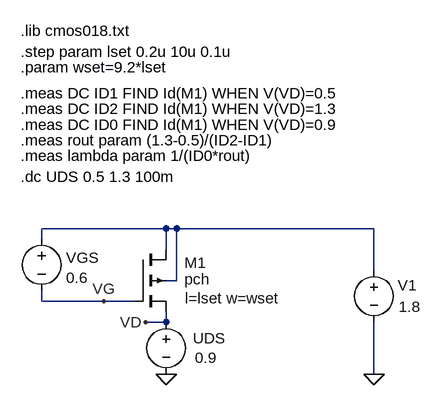
[diagram p0: schematic Draft4P.asc]
Draft4P.asc, the LTspice schematic file:
Version 4
SHEET 1 928 680
WIRE 256 64 64 64
WIRE 272 64 256 64
WIRE 576 64 272 64
WIRE 64 80 64 64
WIRE 256 96 256 64
WIRE 576 128 576 64
WIRE 272 144 272 64
WIRE 272 144 256 144
WIRE 64 176 64 160
WIRE 160 176 64 176
WIRE 208 176 160 176
WIRE 256 208 256 192
WIRE 256 208 224 208
WIRE 576 288 576 208
FLAG 256 288 0
FLAG 576 288 0
FLAG 160 176 VG
FLAG 224 208 VD
SYMBOL voltage 256 192 R0
WINDOW 123 0 0 Left 0
WINDOW 39 0 0 Left 0
WINDOW 0 41 41 Left 2
WINDOW 3 44 71 Left 2
SYMATTR InstName UDS
SYMATTR Value 0.9
SYMBOL voltage 64 64 R0
WINDOW 123 0 0 Left 0
WINDOW 39 0 0 Left 0
WINDOW 0 38 45 Left 2
WINDOW 3 38 76 Left 2
SYMATTR InstName VGS
SYMATTR Value 0.6
SYMBOL pmos4 208 96 R0
WINDOW 0 76 21 Left 2
WINDOW 3 76 46 Left 2
WINDOW 123 77 75 Left 2
SYMATTR InstName M1
SYMATTR Value pch
SYMATTR Value2 l=lset w=wset
SYMBOL voltage 576 112 R0
WINDOW 0 37 39 Left 2
WINDOW 3 38 72 Left 2
WINDOW 123 0 0 Left 0
WINDOW 39 0 0 Left 0
SYMATTR InstName V1
SYMATTR Value 1.8
TEXT 32 -240 Left 2 !.lib cmos018.txt
TEXT 32 -208 Left 2 !.step param lset 0.2u 10u 0.1u
TEXT 32 -144 Left 2 !.meas DC ID1 FIND Id(M1) WHEN V(VD)=0.5
TEXT 32 -120 Left 2 !.meas DC ID2 FIND Id(M1) WHEN V(VD)=1.3
TEXT 32 -96 Left 2 !.meas DC ID0 FIND Id(M1) WHEN V(VD)=0.9
TEXT 32 -72 Left 2 !.meas rout param (1.3-0.5)/(ID2-ID1)
TEXT 32 -48 Left 2 !.meas lambda param 1/(ID0*rout)
TEXT 32 -16 Left 2 !.dc UDS 0.5 1.3 100m
TEXT 32 -184 Left 2 !.param wset=9.2*lset

The netlist it stands for:
* Draft4P.asc
V§UDS VD 0 0.9
VGS N001 VG 0.6
M1 N001 VG VD N001 pch l=lset w=wset
V1 N001 0 1.8
.model NMOS NMOS
.model PMOS PMOS
.lib standard.mos
.lib cmos018.txt
.step param lset 0.2u 10u 0.1u
.meas DC ID1 FIND Id(M1) WHEN V(VD)=0.5
.meas DC ID2 FIND Id(M1) WHEN V(VD)=1.3
.meas DC ID0 FIND Id(M1) WHEN V(VD)=0.9
.meas rout param (1.3-0.5)/(ID2-ID1)
.meas lambda param 1/(ID0*rout)
.dc UDS 0.5 1.3 100m
.param wset=9.2*lset
.backanno
.end